# EAGLE schematic encantado (EAGLE 7.5.0)
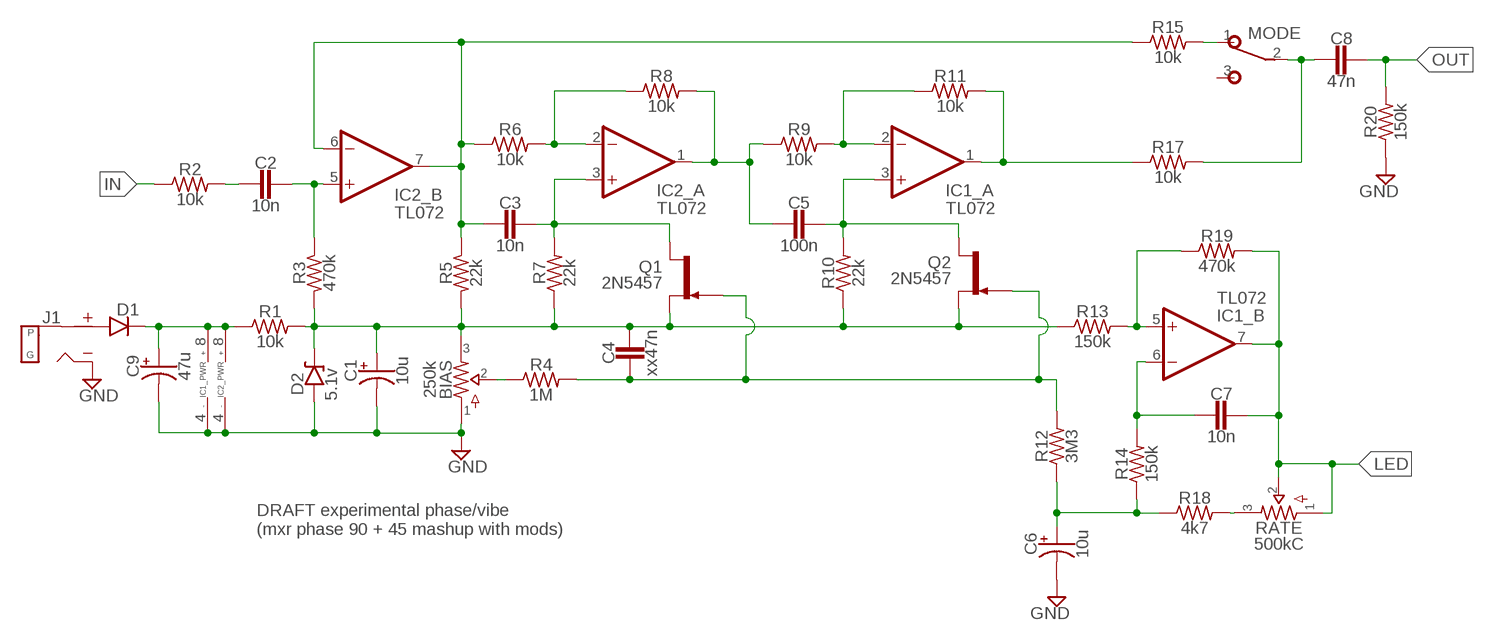
[diagram p0: schematic, sheet 1]

## Parts
BIAS  250k  POTSTRIM  [2262_TRIM]
C1  10u  0501B  [050_020_1B]
C2  10n  CER/FILM2  [050X030_025_2]
C3  10n  CER/FILM2  [050X030_025_2]
C4  xx47n  CER/FILM2  [050X030_025_2]
C5  100n  CER/FILM2  [050X030_025_2]
C6  10u  0501B  [050_020_1B]
C7  10n  CER/FILM2  [050X030_025_2]
C8  47n  CER/FILM2  [050X030_025_2]
C9  47u  0501B  [050_020_1B]
D1  DO35.3  [DO35-3]
D2  5.1v  ZENER.3  [DO41-3]
IC1  TL072  DUALTH  [DIL08]
IC2  TL072  DUALTH  [DIL08]
J1  DC_MONO  [DC]
MODE  SPDTPADS  [SPDT]
Q1  2N5457  [TO92-]
Q2  2N5457  [TO92-]
R1  10k  R_.2  [R0207/2V]
R2  10k  R_.2  [R0207/2V]
R3  470k  R_.2  [R0207/2V]
R4  1M  R_.2  [R0207/2V]
R5  22k  R_.2  [R0207/2V]
R6  10k  R_.2  [R0207/2V]
R7  22k  R_.2  [R0207/2V]
R8  10k  R_.2  [R0207/2V]
R9  10k  R_.2  [R0207/2V]
R10  22k  R_.2  [R0207/2V]
R11  10k  R_.2  [R0207/2V]
R12  3M3  R_.2  [R0207/2V]
R13  150k  R_.2  [R0207/2V]
R14  150k  R_.2  [R0207/2V]
R15  10k  R_.2  [R0207/2V]
R17  10k  R_.2  [R0207/2V]
R18  4k7  R_.2  [R0207/2V]
R19  470k  R_.2  [R0207/2V]
R20  150k  R_.2  [R0207/2V]
RATE  500kC  POTSTRIM  [2262_TRIM]

## Nets
BIAS: C4.1 Q1.1(G) Q2.1(G) R4.2 R12.2
GND: BIAS.1 C1.- C6.- C9.- D2.A IC1.4(_PWR:V-) IC2.4(_PWR:V-) J1.S(SLEEVE) R20.1
IN: R2.1
LED: C7.2 IC1.7(_B:OUT) R19.2 RATE.1 RATE.2
N$1: IC1.2(_A:-IN) R9.2 R11.1
N$2: D1.A J1.T(TIP)
N$3: IC2.2(_A:-IN) R6.2 R8.1
N$4: C3.2 IC2.3(_A:+IN) Q1.3(D) R7.2
N$5: C9.+ D1.C IC1.8(_PWR:V+) IC2.8(_PWR:V+) R1.1
N$6: C5.2 IC1.3(_A:+IN) Q2.3(D) R10.2
N$7: MODE.1(O) R15.2
N$10: IC1.5(_B:+IN) R13.2 R19.1
N$11: C7.1 IC1.6(_B:-IN) R14.2
N$13: R18.2 RATE.3
N$14: C6.+ R12.1 R14.1 R18.1
N$15: BIAS.2 R4.1
N$22: C2.1 R2.2
N$23: C2.2 IC2.5(_B:+IN) R3.1
N$27: C8.1 MODE.2(P) R17.2
OUT: C8.2 R20.2
REF: BIAS.3 C1.+ C4.2 D2.C Q1.2(S) Q2.2(S) R1.2 R3.2 R5.2 R7.1 R10.1 R13.1
S_IN: C3.1 IC2.6(_B:-IN) IC2.7(_B:OUT) R5.1 R6.1 R15.1
S_OUT: C5.1 IC1.1(_A:OUT) IC2.1(_A:OUT) R8.2 R9.1 R11.2 R17.1
Unconnected: MODE.3(S)

## Notes on the sheet
- DRAFT experimental phase/vibe
  (mxr phase 90 + 45 mashup with mods)

## Library data of the parts
BIAS RATE = potentiometers:POTS
C1 C6 C9 = capacitors-elec:050: 0.22 - 100uF Xicon values at Mouser.com: 10V: 10 - 100uF; 16V: 2.2 - 47uF; 25V: 0.47 - 47uF; 50V: 0.22 - 22uF
C2-C5 C7 C8 = capacitors-film:CER/FILM: 47 - 120pF Xicon Ceramic Disc 2.5mm lead spacing
D1 = diodes:DO35: DO-35 Package Diodes: 1N914
D2 = diodes:ZENER
IC1 IC2 = integrated circuits:DUAL: OP AMP
J1 = jacks:DC_MONO
MODE = switches:SPDT: TOGGLE SWITCH Marquardt
Q1 Q2 = transistors:2N5457: N-CHANNEL JFET
R1-R15 R17-R20 = resistors:R_